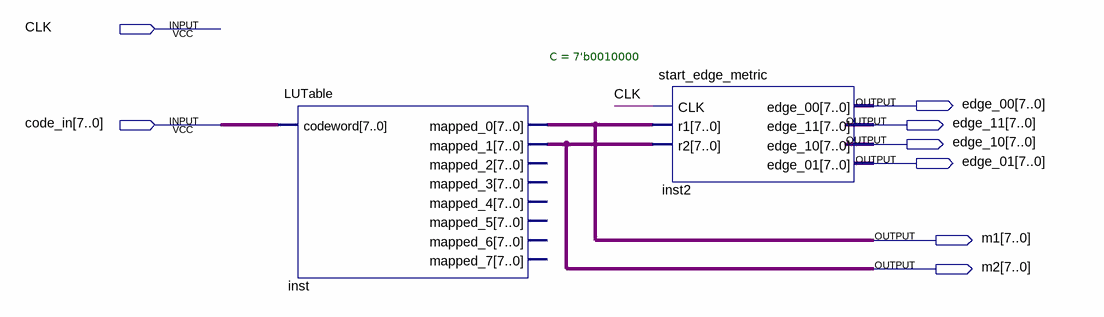
[diagram p0: schematic sheet]
// Quartus schematic test_each_stage.bdf as structural Verilog: 2 symbols, 8 pins
module test_each_stage (
  input  CLK,
  input  [7:0] code_in,
  output [7:0] edge_00,
  output [7:0] edge_11,
  output [7:0] edge_10,
  output [7:0] edge_01,
  output [7:0] m1,
  output [7:0] m2
);

  LUTable #(.C(7'b0010000)) inst (
    .codeword(code_in), .mapped_0(m1), .mapped_1(m2));  // open: mapped_2, mapped_3, mapped_4, mapped_5, mapped_6, mapped_7
  start_edge_metric inst2 (
    .CLK(CLK), .r1(m1), .r2(m2), .edge_00(edge_00), .edge_11(edge_11), .edge_10(edge_10), .edge_01(edge_01));
endmodule
